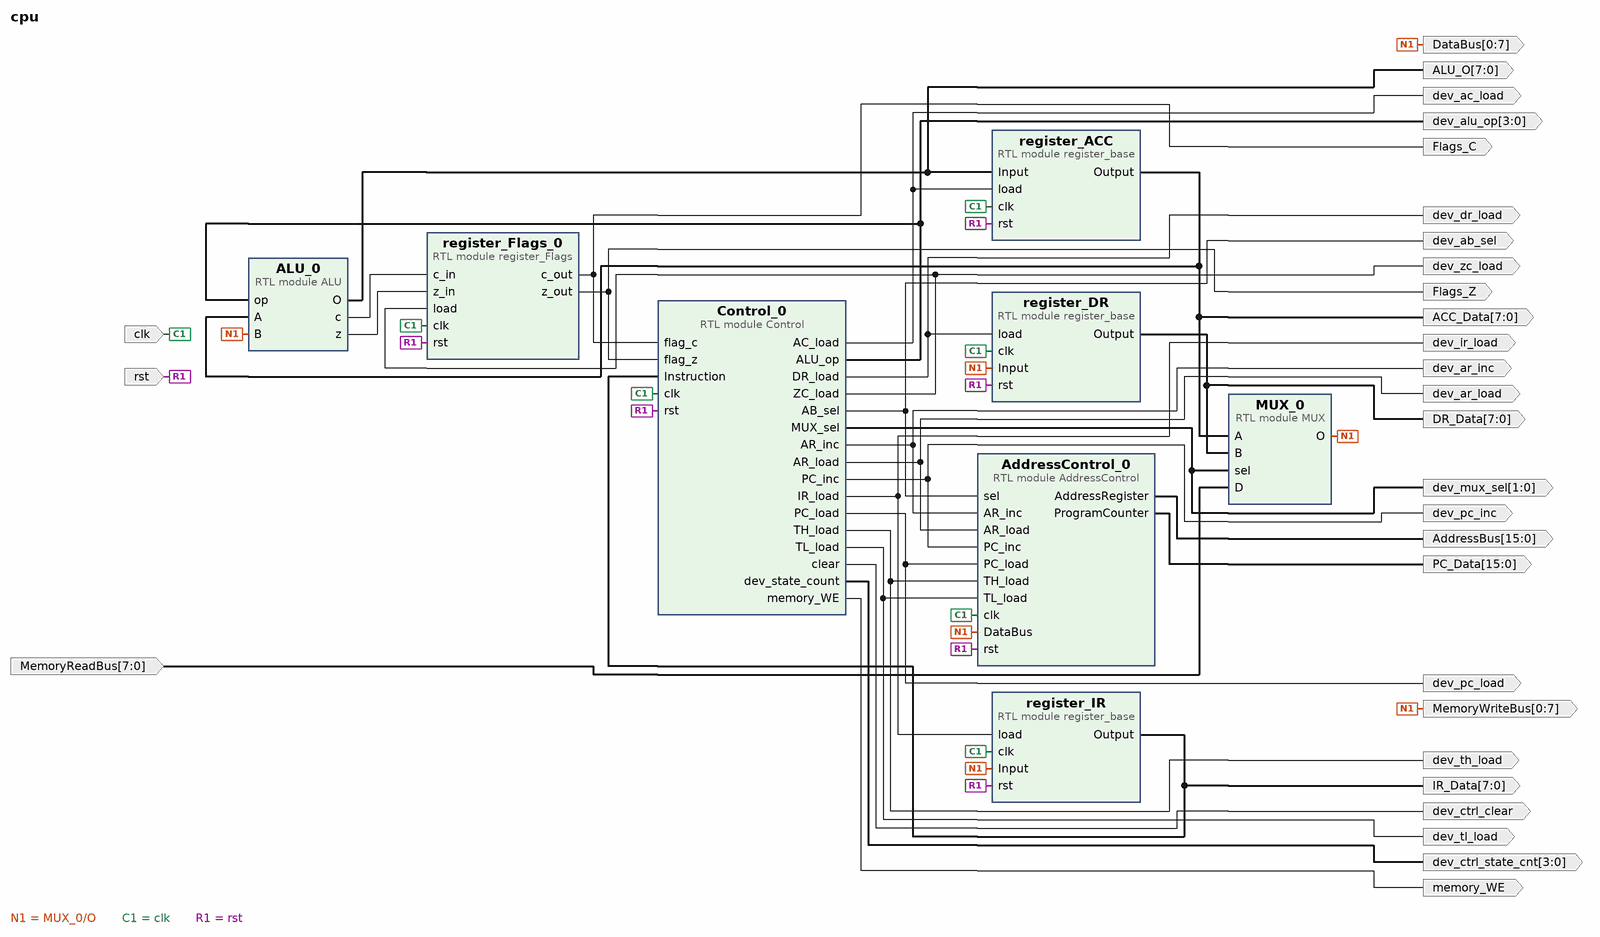
[diagram p0: block diagram of the top level]
# Vivado block design cpu, xc7a35ticsg324-1L, Vivado 2023.2
create_bd_design cpu

create_bd_port -dir I -type clk clk
set_property -dict {CONFIG.FREQ_HZ 100000000} [get_bd_ports clk]
create_bd_port -dir I -type rst rst
set_property -dict {CONFIG.POLARITY ACTIVE_HIGH} [get_bd_ports rst]
create_bd_port -dir O -from 15 -to 0 -type data AddressBus
create_bd_port -dir O -from 0 -to 7 DataBus
create_bd_port -dir O -from 0 -to 7 MemoryWriteBus
create_bd_port -dir I -from 7 -to 0 MemoryReadBus
create_bd_port -dir O -from 15 -to 0 PC_Data
create_bd_port -dir O -from 7 -to 0 DR_Data
create_bd_port -dir O -from 7 -to 0 IR_Data
create_bd_port -dir O -from 7 -to 0 ACC_Data
create_bd_port -dir O Flags_Z
create_bd_port -dir O Flags_C
create_bd_port -dir O -from 7 -to 0 ALU_O
create_bd_port -dir O memory_WE
create_bd_port -dir O dev_ctrl_clear
create_bd_port -dir O dev_ar_load
create_bd_port -dir O dev_pc_load
create_bd_port -dir O dev_pc_inc
create_bd_port -dir O dev_ac_load
create_bd_port -dir O dev_zc_load
create_bd_port -dir O dev_ir_load
create_bd_port -dir O dev_dr_load
create_bd_port -dir O -from 1 -to 0 dev_mux_sel
create_bd_port -dir O dev_ar_inc
create_bd_port -dir O dev_tl_load
create_bd_port -dir O dev_th_load
create_bd_port -dir O dev_ab_sel
create_bd_port -dir O -from 3 -to 0 dev_alu_op
create_bd_port -dir O -from 3 -to 0 dev_ctrl_state_cnt

create_bd_cell -type module -reference register_base register_ACC
create_bd_cell -type module -reference register_base register_DR
create_bd_cell -type module -reference register_base register_IR
create_bd_cell -type module -reference MUX MUX_0
create_bd_cell -type module -reference ALU ALU_0
create_bd_cell -type module -reference register_Flags register_Flags_0
create_bd_cell -type module -reference Control Control_0
create_bd_cell -type module -reference AddressControl AddressControl_0

# ---- connections ----

connect_bd_net [get_bd_pins ALU_0/O] [get_bd_ports ALU_O] [get_bd_pins register_ACC/Input]
connect_bd_net [get_bd_pins ALU_0/c] [get_bd_pins register_Flags_0/c_in]
connect_bd_net [get_bd_pins ALU_0/z] [get_bd_pins register_Flags_0/z_in]
connect_bd_net [get_bd_pins AddressControl_0/AddressRegister] [get_bd_ports AddressBus]
connect_bd_net [get_bd_pins AddressControl_0/ProgramCounter] [get_bd_ports PC_Data]
connect_bd_net [get_bd_pins Control_0/AB_sel] [get_bd_pins AddressControl_0/sel] [get_bd_ports dev_ab_sel]
connect_bd_net [get_bd_pins Control_0/AC_load] [get_bd_pins register_ACC/load] [get_bd_ports dev_ac_load]
connect_bd_net [get_bd_pins Control_0/ALU_op] [get_bd_ports dev_alu_op] [get_bd_pins ALU_0/op]
connect_bd_net [get_bd_pins Control_0/AR_inc] [get_bd_pins AddressControl_0/AR_inc] [get_bd_ports dev_ar_inc]
connect_bd_net [get_bd_pins Control_0/AR_load] [get_bd_ports dev_ar_load] [get_bd_pins AddressControl_0/AR_load]
connect_bd_net [get_bd_pins Control_0/DR_load] [get_bd_pins register_DR/load] [get_bd_ports dev_dr_load]
connect_bd_net [get_bd_pins Control_0/IR_load] [get_bd_pins register_IR/load] [get_bd_ports dev_ir_load]
connect_bd_net [get_bd_pins Control_0/MUX_sel] [get_bd_pins MUX_0/sel] [get_bd_ports dev_mux_sel]
connect_bd_net [get_bd_pins Control_0/PC_inc] [get_bd_ports dev_pc_inc] [get_bd_pins AddressControl_0/PC_inc]
connect_bd_net [get_bd_pins Control_0/PC_load] [get_bd_ports dev_pc_load] [get_bd_pins AddressControl_0/PC_load]
connect_bd_net [get_bd_pins Control_0/TH_load] [get_bd_pins AddressControl_0/TH_load] [get_bd_ports dev_th_load]
connect_bd_net [get_bd_pins Control_0/TL_load] [get_bd_pins AddressControl_0/TL_load] [get_bd_ports dev_tl_load]
connect_bd_net [get_bd_pins Control_0/ZC_load] [get_bd_pins register_Flags_0/load] [get_bd_ports dev_zc_load]
connect_bd_net -net Control_0_dev_clear [get_bd_pins Control_0/clear] [get_bd_ports dev_ctrl_clear]
connect_bd_net [get_bd_pins Control_0/dev_state_count] [get_bd_ports dev_ctrl_state_cnt]
connect_bd_net [get_bd_pins Control_0/memory_WE] [get_bd_ports memory_WE]
connect_bd_net [get_bd_ports MemoryReadBus] [get_bd_pins MUX_0/D]
connect_bd_net -net Net [get_bd_pins MUX_0/O] \
  [get_bd_ports DataBus] [get_bd_ports MemoryWriteBus] [get_bd_pins register_DR/Input] [get_bd_pins register_IR/Input] \
  [get_bd_pins AddressControl_0/DataBus] [get_bd_pins ALU_0/B]
connect_bd_net [get_bd_ports clk] \
  [get_bd_pins register_ACC/clk] [get_bd_pins register_DR/clk] [get_bd_pins register_IR/clk] \
  [get_bd_pins register_Flags_0/clk] [get_bd_pins AddressControl_0/clk] [get_bd_pins Control_0/clk]
connect_bd_net [get_bd_ports rst] \
  [get_bd_pins register_ACC/rst] [get_bd_pins register_DR/rst] [get_bd_pins register_IR/rst] \
  [get_bd_pins register_Flags_0/rst] [get_bd_pins AddressControl_0/rst] [get_bd_pins Control_0/rst]
connect_bd_net [get_bd_pins register_ACC/Output] [get_bd_ports ACC_Data] [get_bd_pins MUX_0/A] [get_bd_pins ALU_0/A]
connect_bd_net [get_bd_pins register_DR/Output] [get_bd_ports DR_Data] [get_bd_pins MUX_0/B]
connect_bd_net [get_bd_pins register_Flags_0/c_out] [get_bd_ports Flags_C] [get_bd_pins Control_0/flag_c]
connect_bd_net [get_bd_pins register_Flags_0/z_out] [get_bd_ports Flags_Z] [get_bd_pins Control_0/flag_z]
connect_bd_net [get_bd_pins register_IR/Output] [get_bd_ports IR_Data] [get_bd_pins Control_0/Instruction]
set_property HDL_ATTRIBUTE.DEBUG true [get_bd_nets Net]
set_property HDL_ATTRIBUTE.MARK_DEBUG true [get_bd_nets Net]

validate_bd_design
save_bd_design
